# Altium schematic sheet 05_COTS_Avionics.SchDoc
size A4; DocumentNumber: 5; SheetNumber: 5; SheetTotal: 5
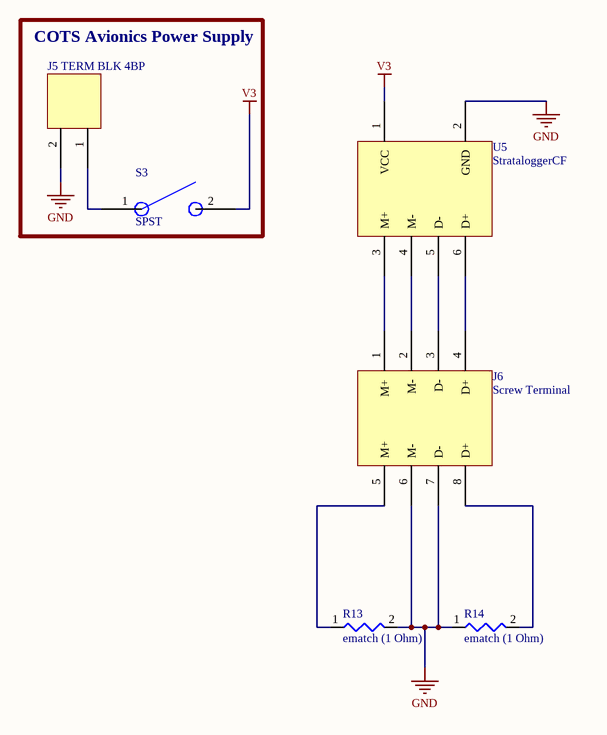
[diagram p0: 05_COTS_Avionics.SchDoc]

## Parts
J5  TERM BLK 4BP  [PCB TERM BLK 2P 2.54MM]
J6  Screw Terminal  [Barrier Screw Terminal]
R13  ematch (1 Ohm)  [ematch]
R14  ematch (1 Ohm)  [ematch]
S3  SPST  [SPST Switch]
U5  StrataloggerCF  [StrataloggerCF]

## Blocks framed on the sheet
COTS Avionics Power Supply: J5 S3

## Nets
GND: J5.2(-) J6.6(M-) J6.7(D-) R13.2(-) R14.1(+) U5.2(GND)
V3: S3.2(-) U5.1(VCC)
NetJ5_1: J5.1(+) S3.1(+)
NetJ6_1: J6.1(M+) U5.3(M+)
NetJ6_2: J6.2(M-) U5.4(M-)
NetJ6_3: J6.3(D-) U5.5(D-)
NetJ6_4: J6.4(D+) U5.6(D+)
NetJ6_5: J6.5(M+) R13.1(+)
NetJ6_8: J6.8(D+) R14.2(-)

## Notes on the sheet
- Title:
- Company:
- Date:
- Sheet
- of
- Drawn By:

## Library data of the parts
J5 = PCB TERM BLK 2P 2.54MM: 2 Position Wire to Board Terminal Block Horizontal with Board 0.100" (2.54mm) Through Hole 10A 150V 16-30 AWG 0.2 Nm M1.6 screw -40°C ~ 105°C; Manufacturer: TE Connectivity; Manufacturer Part Number: 282834-2; Plating: Brass,Steel; Number of Poles: 2; Gender: Male; Number of Levels: 1; Connector Type: Receptacle; Closed End: No (Without); Screwless Terminal Block: Yes (With); Wire Gauge (Max): 30AWG; Tail Length: 3.4mm; Approvals: UL; Supplier 1: Digi-Key; RoHS: Yes; Category: Terminal Blocks; Stock 1: 34508; Pricing 1: 1=1.95000, 10=1.47400, 25=1.36640, 50=1.22860, 100=1.19860, 250=1.04876, 500=0.95886, 1000=0.86896, 5000=0.76409 (USD); Mounting Technology: Through Hole; Contact Plating: Tin; Contact Material: Brass; Color: Green; Material: Nylon; Housing Color: Green; Housing Material: Polyamide; Min Operating Temperature: -40°C; Max Operating Temperature: 105°C; Number of Rows: 1; Max Voltage Rating (AC): 150V; Current Rating: 10A; Voltage Rating: 150V; Package Quantity: 300; Packaging: Bulk; Number of Positions: 2; Termination: Solder; Number of Positions Per Level: 2; Current: 10A; Voltage: 150V; Max Supply Voltage (AC): 150V; Number of Contacts: 2; Number of Circuits: 2; Orientation: Straight; Max Current Rating: 10A; Interlock: No (Without); Screw Flange: No (Without); Side Stackable: Yes (With); Series: Buchanan; Length: 5.54mm; Width: 6.5mm; Wire Gauge (Min): 30AWG; Wire/Cable Gauge: 30AWG; Pitch: 2.54mm; Thread Size: M1.6; Depth: 6.5mm; Radiation Hardening: No; ELV: Compliant; Lead Free: Lead Free; Flammability Rating: UL94 V-0; RoHS Compliant: Yes; ComponentLink1URL: https://datasheet.ciiva.com/16386/282834-2-16386363.pdf?src-supplier=Future+Electronics; ComponentLink1Description: https://datasheet.ciiva.com/16386/282834-2-16386363.pdf?src-supplier=Future+Electronics; ComponentLink2URL: https://datasheet.ciiva.com/30166/eng-cs-1308389-eurostyle-terminal-blocks-0607-30166974.pdf?src-supplier=Onlinecomponents.com; ComponentLink2Description: https://datasheet.ciiva.com/30166/eng-cs-1308389-eurostyle-terminal-blocks-0607-30166974.pdf?src-supplier=Onlinecomponents.com; ComponentLink3URL: https://datasheet.ciiva.com/14609/70086732-14609670.pdf?src-supplier=Allied+Electronics; ComponentLink3Description: https://datasheet.ciiva.com/14609/70086732-14609670.pdf?src-supplier=Allied+Electronics; ComponentLink4URL: https://datasheet.ciiva.com/15169/getdatasheetpartid-155864-15169558.pdf?src-supplier=Verical; ComponentLink4Description: https://datasheet.ciiva.com/15169/getdatasheetpartid-155864-15169558.pdf?src-supplier=Verical; ComponentLink5URL: https://datasheet.ciiva.com/3141/eng-cs-1308389-eurostyle-terminal-blocks-0607-3141115.pdf?src-supplier=Avnet; ComponentLink5Description: https://datasheet.ciiva.com/3141/eng-cs-1308389-eurostyle-terminal-blocks-0607-3141115.pdf?src-supplier=Avnet; Supplier Part Number 1: A98333-ND
J6 = Barrier Screw Terminal
R13 R14 = ematch: ematch of 1.0-1.5 Ohms of resistance that lights black powder ejection charges.
S3 = SPST Switch
U5 = StrataloggerCF: PerfectFlite StrataloggerCF COTS altimeter.